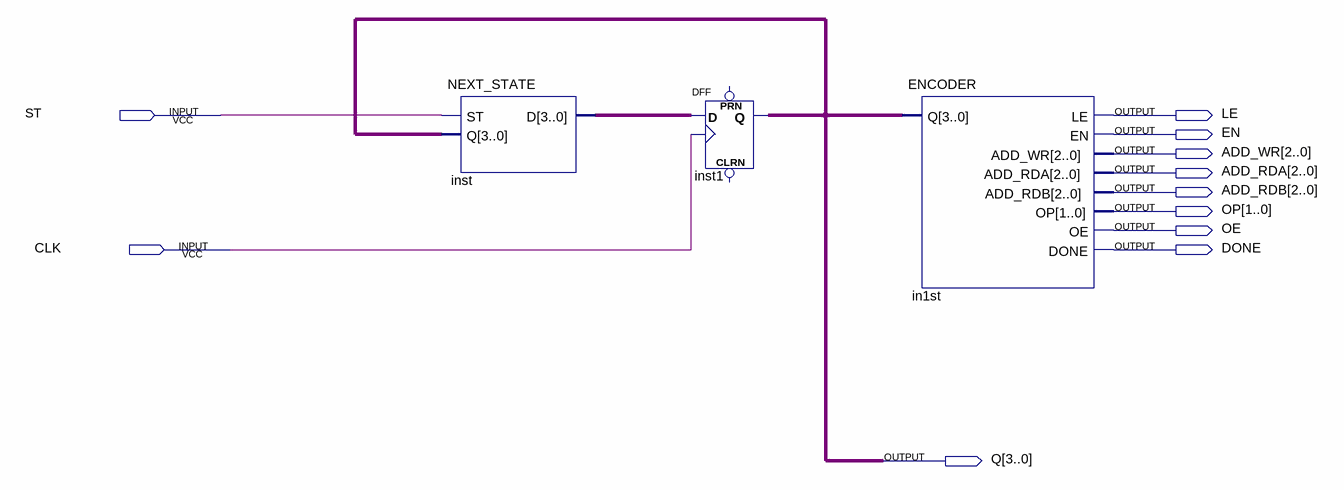
[diagram p0: schematic sheet]
// Quartus schematic CONTROL.bdf as structural Verilog: 3 symbols, 11 pins
module CONTROL (
  input  ST,
  input  CLK,
  output LE,
  output EN,
  output [2:0] ADD_WR,
  output [2:0] ADD_RDA,
  output [2:0] ADD_RDB,
  output [1:0] OP,
  output OE,
  output DONE,
  output [3:0] Q
);

  wire [3:0] inst_d;

  NEXT_STATE inst (.ST(ST), .Q(Q), .D(inst_d));
  DFF inst1[3:0] (.CLK(CLK), .D(inst_d), .Q(Q));  // open: CLRN, PRN
  ENCODER in1st (
    .Q(Q), .LE(LE), .EN(EN), .ADD_WR(ADD_WR), .ADD_RDA(ADD_RDA), .ADD_RDB(ADD_RDB), .OP(OP), .OE(OE),
    .DONE(DONE));
endmodule
